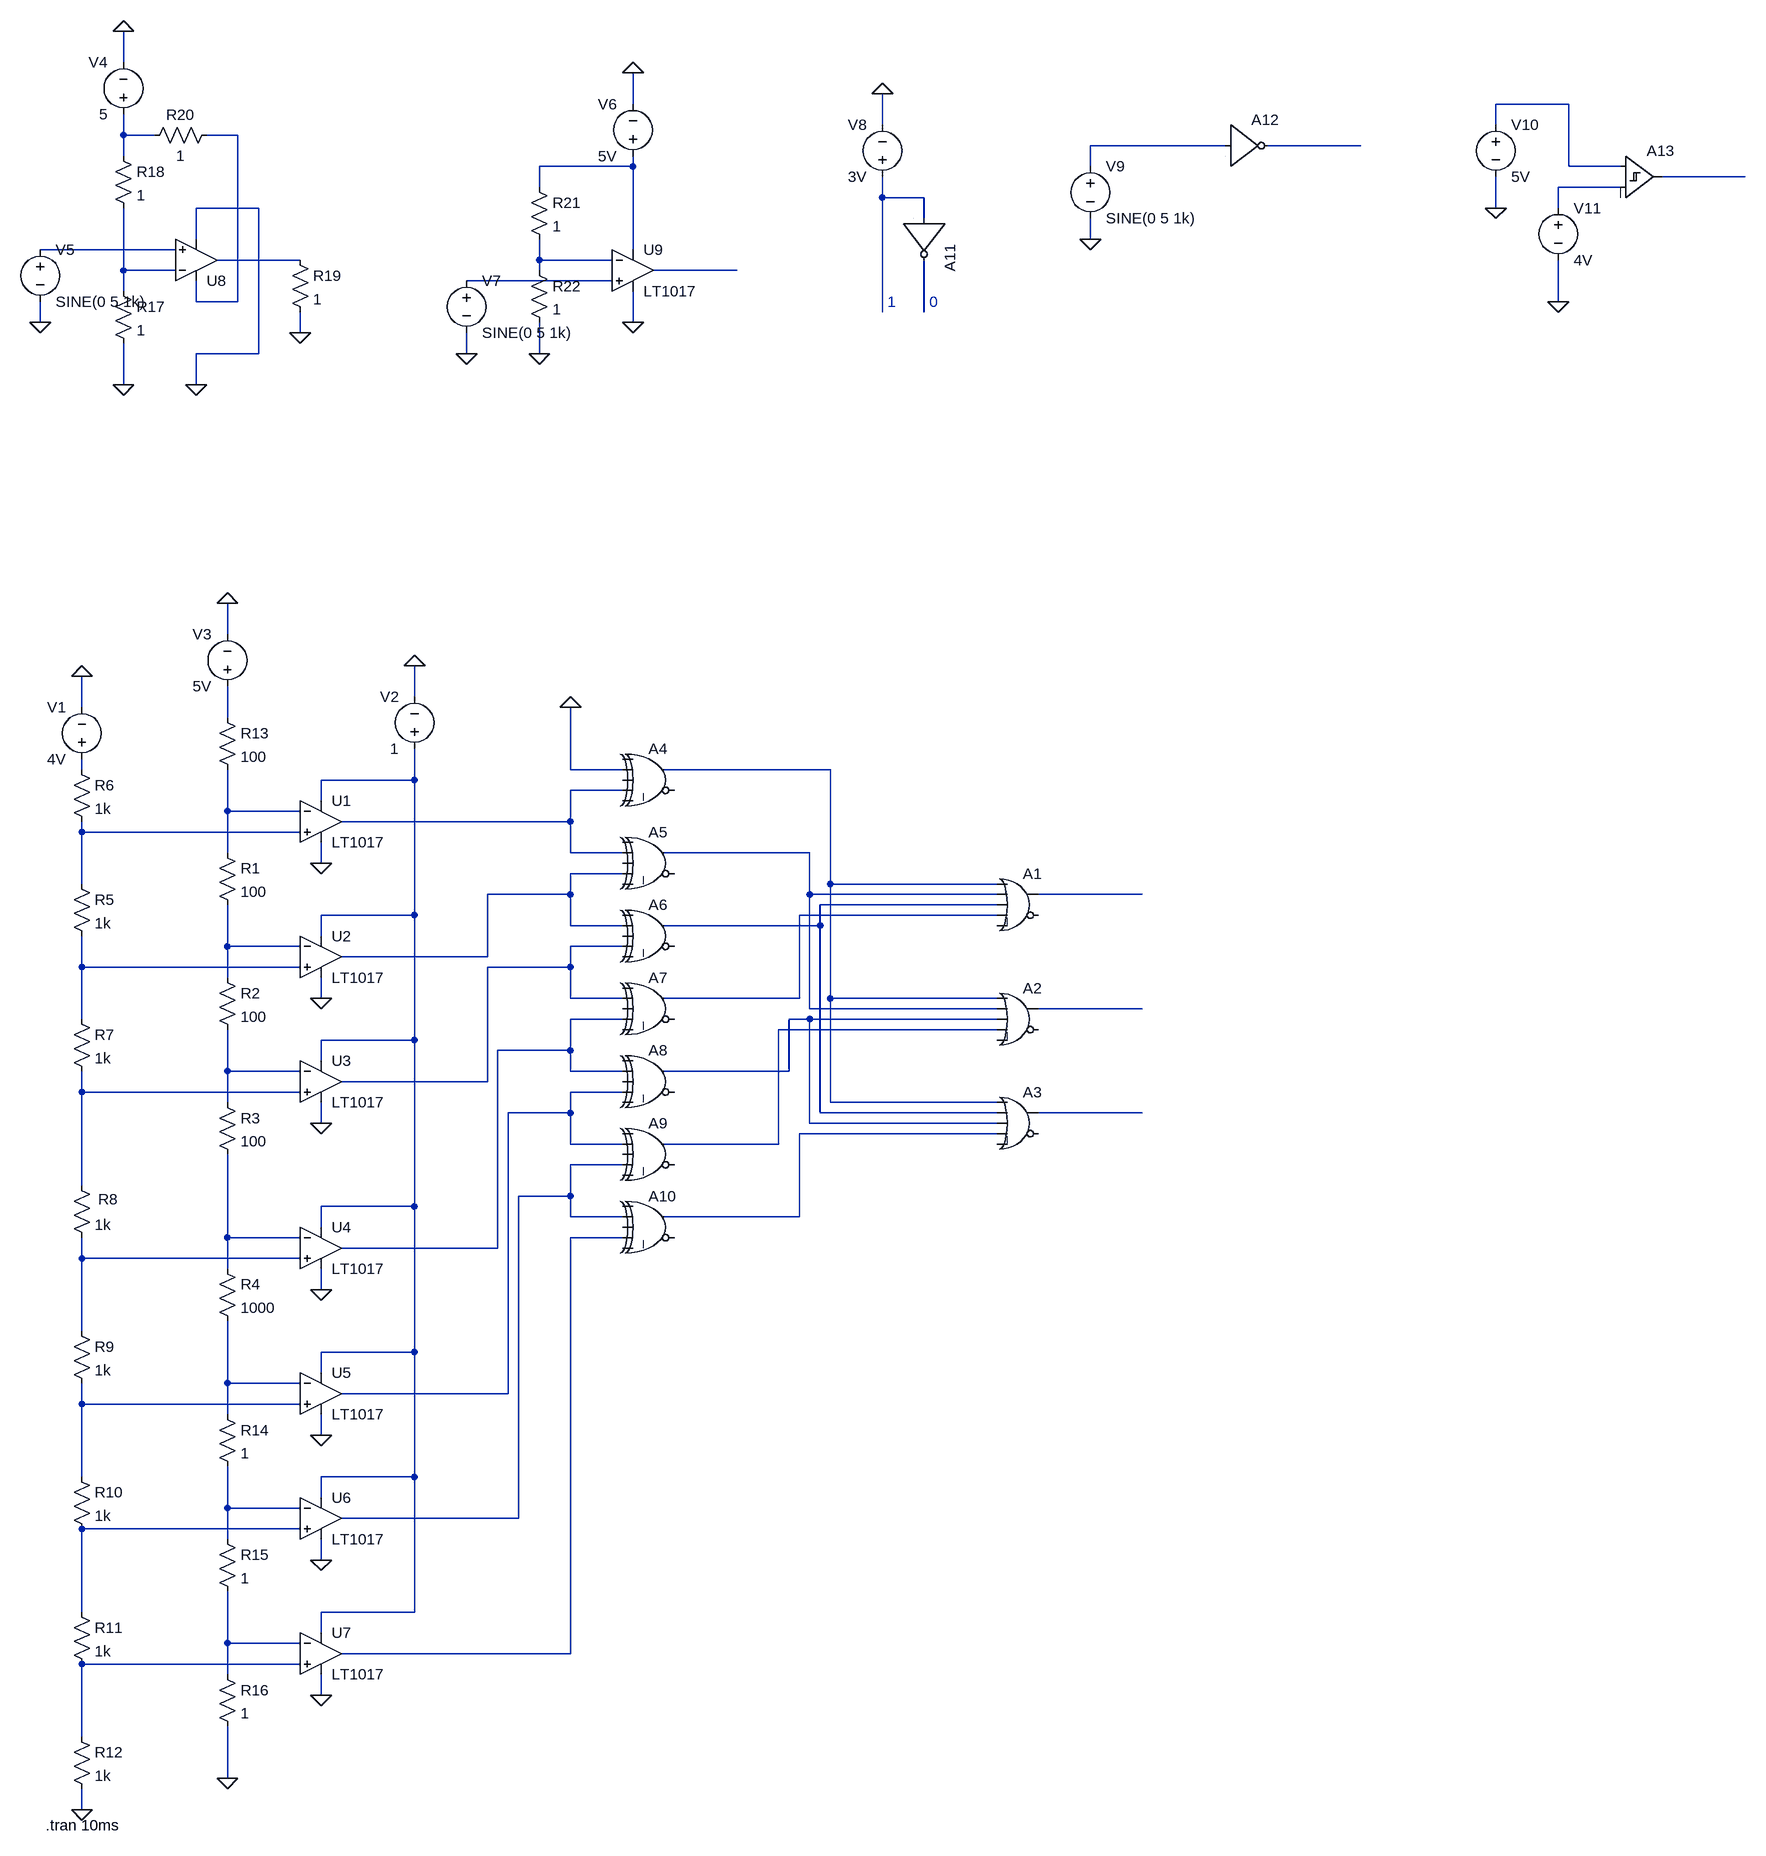
[diagram p0: schematic Ltspice_Analog_Detect_Sample.asc]
Ltspice_Analog_Detect_Sample.asc, the LTspice schematic file:
Version 4
SHEET 1 1908 1144
WIRE -592 -1584 -592 -1632
WIRE 192 -1520 192 -1568
WIRE 1632 -1520 1520 -1520
WIRE 576 -1488 576 -1536
WIRE 1520 -1488 1520 -1520
WIRE -592 -1472 -592 -1504
WIRE -544 -1472 -592 -1472
WIRE -416 -1472 -464 -1472
WIRE 1104 -1456 896 -1456
WIRE 1312 -1456 1168 -1456
WIRE -592 -1440 -592 -1472
WIRE 192 -1424 192 -1440
WIRE 192 -1424 48 -1424
WIRE 896 -1424 896 -1456
WIRE 1632 -1424 1632 -1520
WIRE 1712 -1424 1632 -1424
WIRE 1904 -1408 1776 -1408
WIRE 48 -1392 48 -1424
WIRE 1712 -1392 1616 -1392
WIRE 576 -1376 576 -1408
WIRE 640 -1376 576 -1376
WIRE -384 -1360 -480 -1360
WIRE 1520 -1360 1520 -1408
WIRE 1616 -1360 1616 -1392
WIRE 640 -1344 640 -1376
WIRE -480 -1312 -480 -1360
WIRE 896 -1312 896 -1344
WIRE -512 -1296 -720 -1296
WIRE 192 -1296 192 -1424
WIRE -320 -1280 -448 -1280
WIRE 48 -1280 48 -1312
WIRE 160 -1280 48 -1280
WIRE -592 -1264 -592 -1360
WIRE -512 -1264 -592 -1264
WIRE 48 -1264 48 -1280
WIRE 352 -1264 224 -1264
WIRE 160 -1248 -64 -1248
WIRE -592 -1232 -592 -1264
WIRE -480 -1216 -480 -1248
WIRE -416 -1216 -416 -1472
WIRE -416 -1216 -480 -1216
WIRE 1616 -1216 1616 -1280
WIRE 576 -1200 576 -1376
WIRE 640 -1200 640 -1280
WIRE -720 -1184 -720 -1216
WIRE 192 -1184 192 -1232
WIRE -320 -1168 -320 -1200
WIRE -384 -1136 -384 -1360
WIRE -384 -1136 -480 -1136
WIRE -64 -1136 -64 -1168
WIRE 48 -1136 48 -1184
WIRE -592 -1088 -592 -1152
WIRE -480 -1088 -480 -1136
WIRE -432 -704 -432 -752
WIRE -144 -608 -144 -656
WIRE -656 -592 -656 -640
WIRE -432 -576 -432 -624
WIRE -656 -496 -656 -512
WIRE 96 -496 96 -592
WIRE 176 -496 96 -496
WIRE 496 -496 240 -496
WIRE -144 -480 -144 -528
WIRE -144 -480 -288 -480
WIRE 176 -464 96 -464
WIRE -288 -448 -288 -480
WIRE -432 -432 -432 -496
WIRE -320 -432 -432 -432
WIRE 96 -416 96 -464
WIRE 96 -416 -256 -416
WIRE -656 -400 -656 -416
WIRE -320 -400 -656 -400
WIRE -432 -368 -432 -432
WIRE 96 -368 96 -416
WIRE 176 -368 96 -368
WIRE 464 -368 240 -368
WIRE -288 -352 -288 -384
WIRE 176 -336 96 -336
WIRE -656 -320 -656 -400
WIRE 496 -320 496 -496
WIRE 752 -320 496 -320
WIRE 96 -304 96 -336
WIRE 96 -304 -32 -304
WIRE 464 -304 464 -368
WIRE 752 -304 464 -304
WIRE 976 -304 816 -304
WIRE 752 -288 480 -288
WIRE -144 -272 -144 -480
WIRE -144 -272 -288 -272
WIRE 752 -272 448 -272
WIRE 96 -256 96 -304
WIRE 176 -256 96 -256
WIRE 480 -256 480 -288
WIRE 480 -256 240 -256
WIRE -288 -240 -288 -272
WIRE -432 -224 -432 -288
WIRE -320 -224 -432 -224
WIRE 176 -224 96 -224
WIRE -32 -208 -32 -304
WIRE -32 -208 -256 -208
WIRE -656 -192 -656 -240
WIRE -320 -192 -656 -192
WIRE 96 -192 96 -224
WIRE 96 -192 -32 -192
WIRE -432 -176 -432 -224
WIRE -288 -144 -288 -176
WIRE 96 -144 96 -192
WIRE 176 -144 96 -144
WIRE 448 -144 448 -272
WIRE 448 -144 240 -144
WIRE 496 -144 496 -320
WIRE 752 -144 496 -144
WIRE 464 -128 464 -304
WIRE 752 -128 464 -128
WIRE 976 -128 816 -128
WIRE -656 -112 -656 -192
WIRE 176 -112 96 -112
WIRE 464 -112 432 -112
WIRE 752 -112 464 -112
WIRE 752 -96 416 -96
WIRE -144 -80 -144 -272
WIRE -144 -80 -288 -80
WIRE 96 -64 96 -112
WIRE 96 -64 -16 -64
WIRE -288 -48 -288 -80
WIRE -432 -32 -432 -96
WIRE -320 -32 -432 -32
WIRE 96 -32 96 -64
WIRE 176 -32 96 -32
WIRE 432 -32 432 -112
WIRE 432 -32 240 -32
WIRE -32 -16 -32 -192
WIRE -32 -16 -256 -16
WIRE -656 0 -656 -32
WIRE -320 0 -656 0
WIRE 176 0 96 0
WIRE -432 16 -432 -32
WIRE 496 16 496 -144
WIRE 752 16 496 16
WIRE 96 32 96 0
WIRE 96 32 0 32
WIRE 480 32 480 -256
WIRE 752 32 480 32
WIRE 976 32 816 32
WIRE -288 48 -288 16
WIRE 464 48 464 -112
WIRE 752 48 464 48
WIRE 752 64 448 64
WIRE 96 80 96 32
WIRE 176 80 96 80
WIRE 416 80 416 -96
WIRE 416 80 240 80
WIRE 176 112 96 112
WIRE -656 144 -656 0
WIRE 96 160 96 112
WIRE 96 160 16 160
WIRE -144 176 -144 -80
WIRE -144 176 -288 176
WIRE 96 192 96 160
WIRE 176 192 96 192
WIRE 448 192 448 64
WIRE 448 192 240 192
WIRE -288 208 -288 176
WIRE -432 224 -432 96
WIRE -320 224 -432 224
WIRE 176 224 96 224
WIRE -16 240 -16 -64
WIRE -16 240 -256 240
WIRE -656 256 -656 224
WIRE -320 256 -656 256
WIRE -432 272 -432 224
WIRE -288 304 -288 272
WIRE -656 368 -656 256
WIRE -144 400 -144 176
WIRE -144 400 -288 400
WIRE -288 432 -288 400
WIRE -432 448 -432 352
WIRE -320 448 -432 448
WIRE 0 464 0 32
WIRE 0 464 -256 464
WIRE -656 480 -656 448
WIRE -320 480 -656 480
WIRE -432 496 -432 448
WIRE -288 528 -288 496
WIRE -656 592 -656 480
WIRE -144 592 -144 400
WIRE -144 592 -288 592
WIRE -288 624 -288 592
WIRE -432 640 -432 576
WIRE -320 640 -432 640
WIRE 16 656 16 160
WIRE 16 656 -256 656
WIRE -320 672 -656 672
WIRE -432 688 -432 640
WIRE -288 720 -288 688
WIRE -656 800 -656 672
WIRE -144 800 -144 592
WIRE -144 800 -288 800
WIRE -288 832 -288 800
WIRE -432 848 -432 768
WIRE -320 848 -432 848
WIRE 96 864 96 224
WIRE 96 864 -256 864
WIRE -320 880 -656 880
WIRE -432 896 -432 848
WIRE -288 928 -288 896
WIRE -656 992 -656 880
WIRE -432 1056 -432 976
WIRE -656 1104 -656 1072
FLAG -656 -640 0
FLAG -656 1104 0
FLAG -144 -656 0
FLAG -432 1056 0
FLAG -288 928 0
FLAG -288 720 0
FLAG -288 528 0
FLAG -288 304 0
FLAG -288 48 0
FLAG -288 -144 0
FLAG -288 -352 0
FLAG -432 -752 0
FLAG 96 -592 0
FLAG -480 -1088 0
FLAG -720 -1184 0
FLAG -592 -1632 0
FLAG -592 -1088 0
FLAG -320 -1168 0
FLAG 192 -1184 0
FLAG 192 -1568 0
FLAG 48 -1136 0
FLAG -64 -1136 0
FLAG 576 -1536 0
FLAG 896 -1312 0
FLAG 1520 -1360 0
FLAG 1616 -1216 0
SYMBOL res -448 -384 R0
SYMATTR InstName R1
SYMATTR Value 100
SYMBOL res -448 -192 R0
SYMATTR InstName R2
SYMATTR Value 100
SYMBOL res -448 0 R0
SYMATTR InstName R3
SYMATTR Value 100
SYMBOL res -448 256 R0
SYMATTR InstName R4
SYMATTR Value 1000
SYMBOL res -672 -336 R0
SYMATTR InstName R5
SYMATTR Value 1k
SYMBOL voltage -656 -496 R180
WINDOW 0 24 96 Left 2
WINDOW 3 24 16 Left 2
WINDOW 123 0 0 Left 0
WINDOW 39 0 0 Left 0
SYMATTR InstName V1
SYMATTR Value 4V
SYMBOL res -672 -512 R0
SYMATTR InstName R6
SYMATTR Value 1k
SYMBOL res -672 -128 R0
SYMATTR InstName R7
SYMATTR Value 1k
SYMBOL res -672 128 R0
WINDOW 0 41 37 Left 2
SYMATTR InstName R8
SYMATTR Value 1k
SYMBOL res -672 352 R0
SYMATTR InstName R9
SYMATTR Value 1k
SYMBOL res -672 576 R0
SYMATTR InstName R10
SYMATTR Value 1k
SYMBOL res -672 784 R0
SYMATTR InstName R11
SYMATTR Value 1k
SYMBOL res -672 976 R0
SYMATTR InstName R12
SYMATTR Value 1k
SYMBOL Comparators\\LT1017 -288 -416 R0
SYMATTR InstName U1
SYMBOL voltage -144 -512 R180
WINDOW 0 24 96 Left 2
WINDOW 3 24 16 Left 2
SYMATTR InstName V2
SYMATTR Value 1
SYMBOL voltage -432 -608 R180
WINDOW 0 24 96 Left 2
WINDOW 3 24 16 Left 2
SYMATTR InstName V3
SYMATTR Value 5V
SYMBOL res -448 -592 R0
SYMATTR InstName R13
SYMATTR Value 100
SYMBOL res -448 480 R0
SYMATTR InstName R14
SYMATTR Value 1
SYMBOL res -448 672 R0
SYMATTR InstName R15
SYMATTR Value 1
SYMBOL res -448 880 R0
SYMATTR InstName R16
SYMATTR Value 1
SYMBOL Comparators\\LT1017 -288 -208 R0
SYMATTR InstName U2
SYMBOL Comparators\\LT1017 -288 -16 R0
SYMATTR InstName U3
SYMBOL Comparators\\LT1017 -288 240 R0
SYMATTR InstName U4
SYMBOL Comparators\\LT1017 -288 464 R0
SYMATTR InstName U5
SYMBOL Comparators\\LT1017 -288 656 R0
SYMATTR InstName U6
SYMBOL Comparators\\LT1017 -288 864 R0
SYMATTR InstName U7
SYMBOL Digital\\or 784 -352 R0
SYMATTR InstName A1
SYMBOL Digital\\or 784 -176 R0
SYMATTR InstName A2
SYMBOL Digital\\or 784 -16 R0
SYMATTR InstName A3
SYMBOL Digital\\xor 224 -544 R0
SYMATTR InstName A4
SYMBOL Digital\\xor 224 -416 R0
SYMATTR InstName A5
SYMBOL Digital\\xor 224 -304 R0
SYMATTR InstName A6
SYMBOL Digital\\xor 224 -192 R0
SYMATTR InstName A7
SYMBOL Digital\\xor 224 -80 R0
SYMATTR InstName A8
SYMBOL Digital\\xor 224 32 R0
SYMATTR InstName A9
SYMBOL Digital\\xor 224 144 R0
SYMATTR InstName A10
SYMBOL res -608 -1248 R0
SYMATTR InstName R17
SYMATTR Value 1
SYMBOL res -608 -1456 R0
SYMATTR InstName R18
SYMATTR Value 1
SYMBOL voltage -592 -1488 R180
WINDOW 0 24 96 Left 2
WINDOW 3 24 16 Left 2
SYMATTR InstName V4
SYMATTR Value 5
SYMBOL voltage -720 -1312 R0
WINDOW 123 0 0 Left 0
WINDOW 39 0 0 Left 0
SYMATTR InstName V5
SYMATTR Value SINE(0 5 1k)
SYMBOL OpAmps\\UniversalOpAmp -480 -1280 M180
SYMATTR InstName U8
SYMBOL res -336 -1296 R0
SYMATTR InstName R19
SYMATTR Value 1
SYMBOL res -448 -1488 R90
WINDOW 0 0 56 VBottom 2
WINDOW 3 32 56 VTop 2
SYMATTR InstName R20
SYMATTR Value 1
SYMBOL Comparators\\LT1017 192 -1264 R0
SYMATTR InstName U9
SYMBOL voltage 192 -1424 R180
WINDOW 0 24 96 Left 2
WINDOW 3 24 16 Left 2
SYMATTR InstName V6
SYMATTR Value 5V
SYMBOL res 32 -1408 R0
SYMATTR InstName R21
SYMATTR Value 1
SYMBOL res 32 -1280 R0
SYMATTR InstName R22
SYMATTR Value 1
SYMBOL voltage -64 -1264 R0
WINDOW 123 0 0 Left 0
WINDOW 39 0 0 Left 0
SYMATTR InstName V7
SYMATTR Value SINE(0 5 1k)
SYMBOL Digital\\inv 704 -1344 R90
SYMATTR InstName A11
SYMBOL voltage 576 -1392 R180
WINDOW 0 24 96 Left 2
WINDOW 3 24 16 Left 2
SYMATTR InstName V8
SYMATTR Value 3V
SYMBOL Digital\\inv 1104 -1520 R0
SYMATTR InstName A12
SYMBOL voltage 896 -1440 R0
WINDOW 123 0 0 Left 0
WINDOW 39 0 0 Left 0
SYMATTR InstName V9
SYMATTR Value SINE(0 5 1k)
SYMBOL Digital\\diffschmtbuf 1712 -1472 R0
SYMATTR InstName A13
SYMBOL voltage 1520 -1504 R0
WINDOW 123 0 0 Left 0
WINDOW 39 0 0 Left 0
SYMATTR InstName V10
SYMATTR Value 5V
SYMBOL voltage 1616 -1376 R0
SYMATTR InstName V11
SYMATTR Value 4V
TEXT -712 1128 Left 2 !.tran 10ms
TEXT 648 -1216 Left 2 ;0
TEXT 584 -1216 Left 2 ;1

The netlist it stands for:
* Ltspice_Analog_Detect_Sample.asc
R1 N022 N029 100
R2 N029 N036 100
R3 N036 N042 100
R4 N042 N045 1000
R5 N023 N031 1k
V1 N018 0 4V
R6 N018 N023 1k
R7 N031 N037 1k
R8 N037 N044 1k
R9 N044 N046 1k
R10 N046 N048 1k
R11 N048 N050 1k
R12 N050 0 1k
XU1 N023 N022 N020 0 N021 LT1017  ; pins In+ In- V+ V- OUT
V2 N020 0 1
V3 N017 0 5V
R13 N017 N022 100
R14 N045 N047 1
R15 N047 N049 1
R16 N049 0 1
XU2 N031 N029 N020 0 N025 LT1017  ; pins In+ In- V+ V- OUT
XU3 N037 N036 N020 0 N030 LT1017  ; pins In+ In- V+ V- OUT
XU4 N044 N042 N020 0 N033 LT1017  ; pins In+ In- V+ V- OUT
XU5 N046 N045 N020 0 N038 LT1017  ; pins In+ In- V+ V- OUT
XU6 N048 N047 N020 0 N041 LT1017  ; pins In+ In- V+ V- OUT
XU7 N050 N049 N020 0 N043 LT1017  ; pins In+ In- V+ V- OUT
A1 N019 N024 N027 N028 0 0 N026 0 OR
A2 N019 N024 N034 N035 0 0 N032 0 OR
A3 N019 N027 N034 N040 0 0 N039 0 OR
A4 0 0 0 N021 0 0 N019 0 XOR
A5 0 N021 0 N025 0 0 N024 0 XOR
A6 0 N025 0 N030 0 0 N027 0 XOR
A7 0 N030 0 N033 0 0 N028 0 XOR
A8 0 N033 0 N038 0 0 N034 0 XOR
A9 0 N038 0 N041 0 0 N035 0 XOR
A10 0 N041 0 N043 0 0 N040 0 XOR
R17 N013 0 1
R18 N002 N013 1
V4 N002 0 5
V5 N010 0 SINE(0 5 1k)
XU8 N010 N013 N003 0 N011 level1 Avol=1Meg GBW=10Meg Vos=0 En=0 Enk=0 In=0 Ink=0 Rin=500Meg  ; pins In+ In- V+ V- OUT
R19 N011 0 1
R20 N003 N002 1
XU9 N015 N012 N006 0 N014 LT1017  ; pins In+ In- V+ V- OUT
V6 N006 0 5V
R21 N006 N012 1
R22 N012 0 1
V7 N015 0 SINE(0 5 1k)
A11 N009 0 0 0 0 N016 0 0 BUF
V8 N009 0 3V
A12 N004 0 0 0 0 N005 0 0 BUF
V9 N004 0 SINE(0 5 1k)
A13 N001 N008 0 0 0 0 N007 0 SCHMITT
V10 N001 0 5V
V11 N008 0 4V
.tran 10ms
* 0
* 1
.lib UniversalOpAmp1.lib
.backanno
.end